# Altium schematic sheet Sheet1.SchDoc
size A2; SheetNumber: 1; SheetTotal: 1
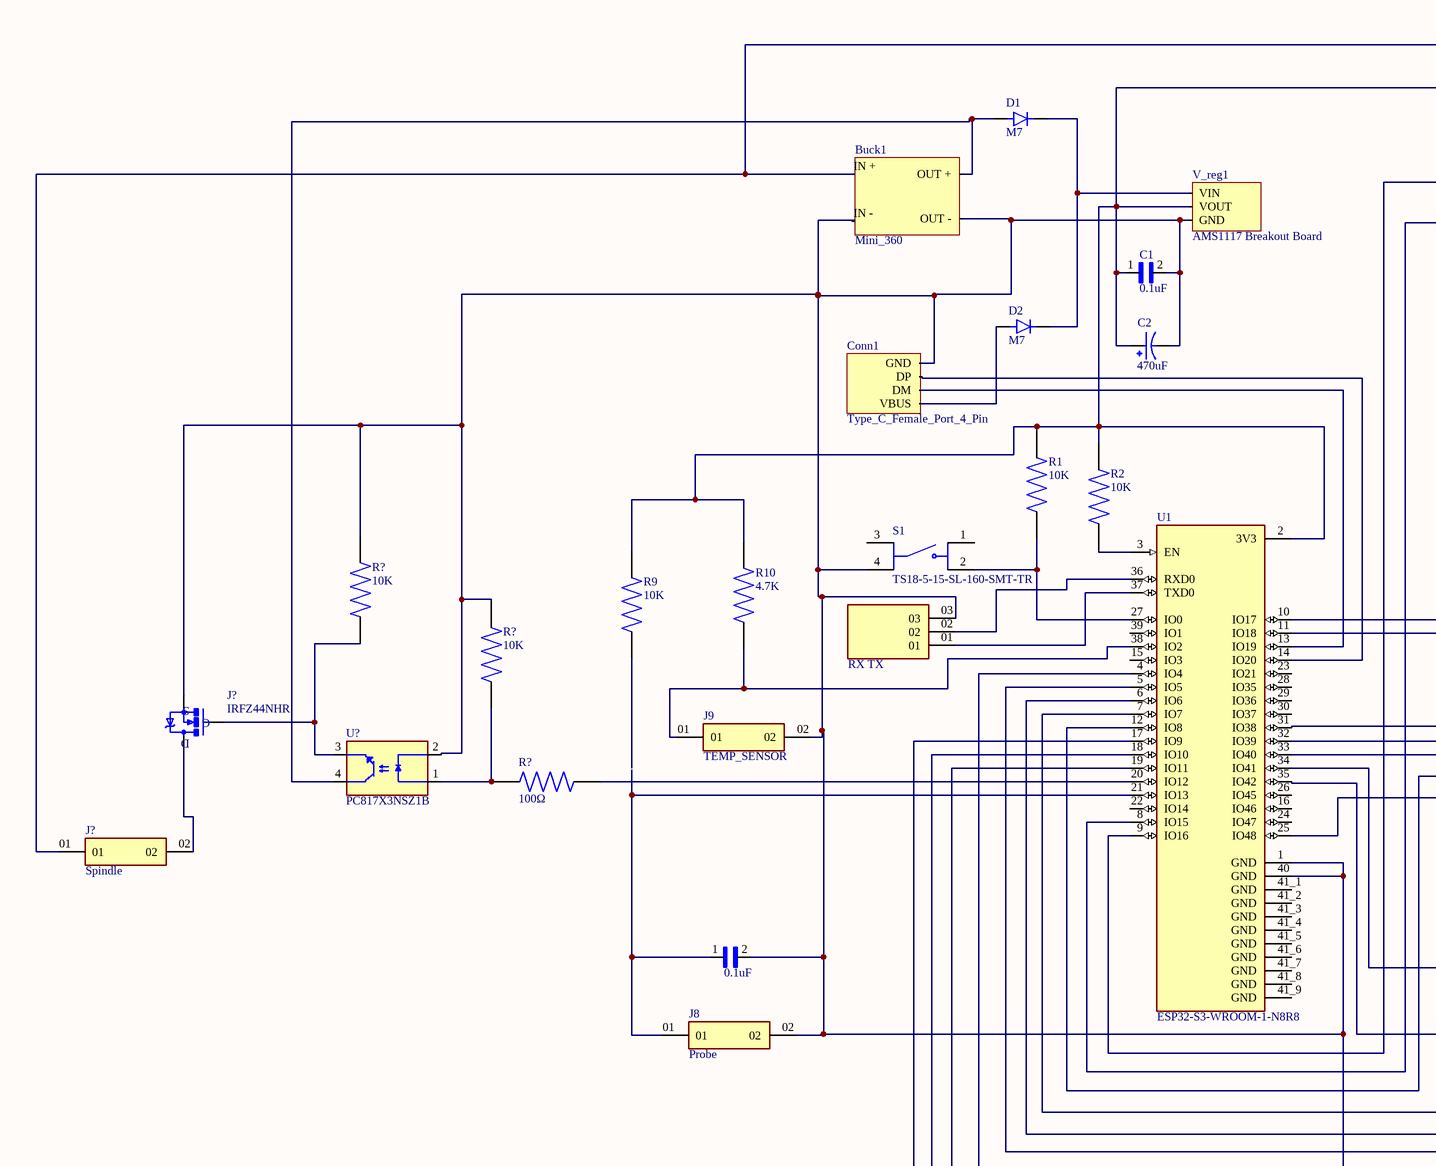
[diagram p0: Sheet1.SchDoc, left]
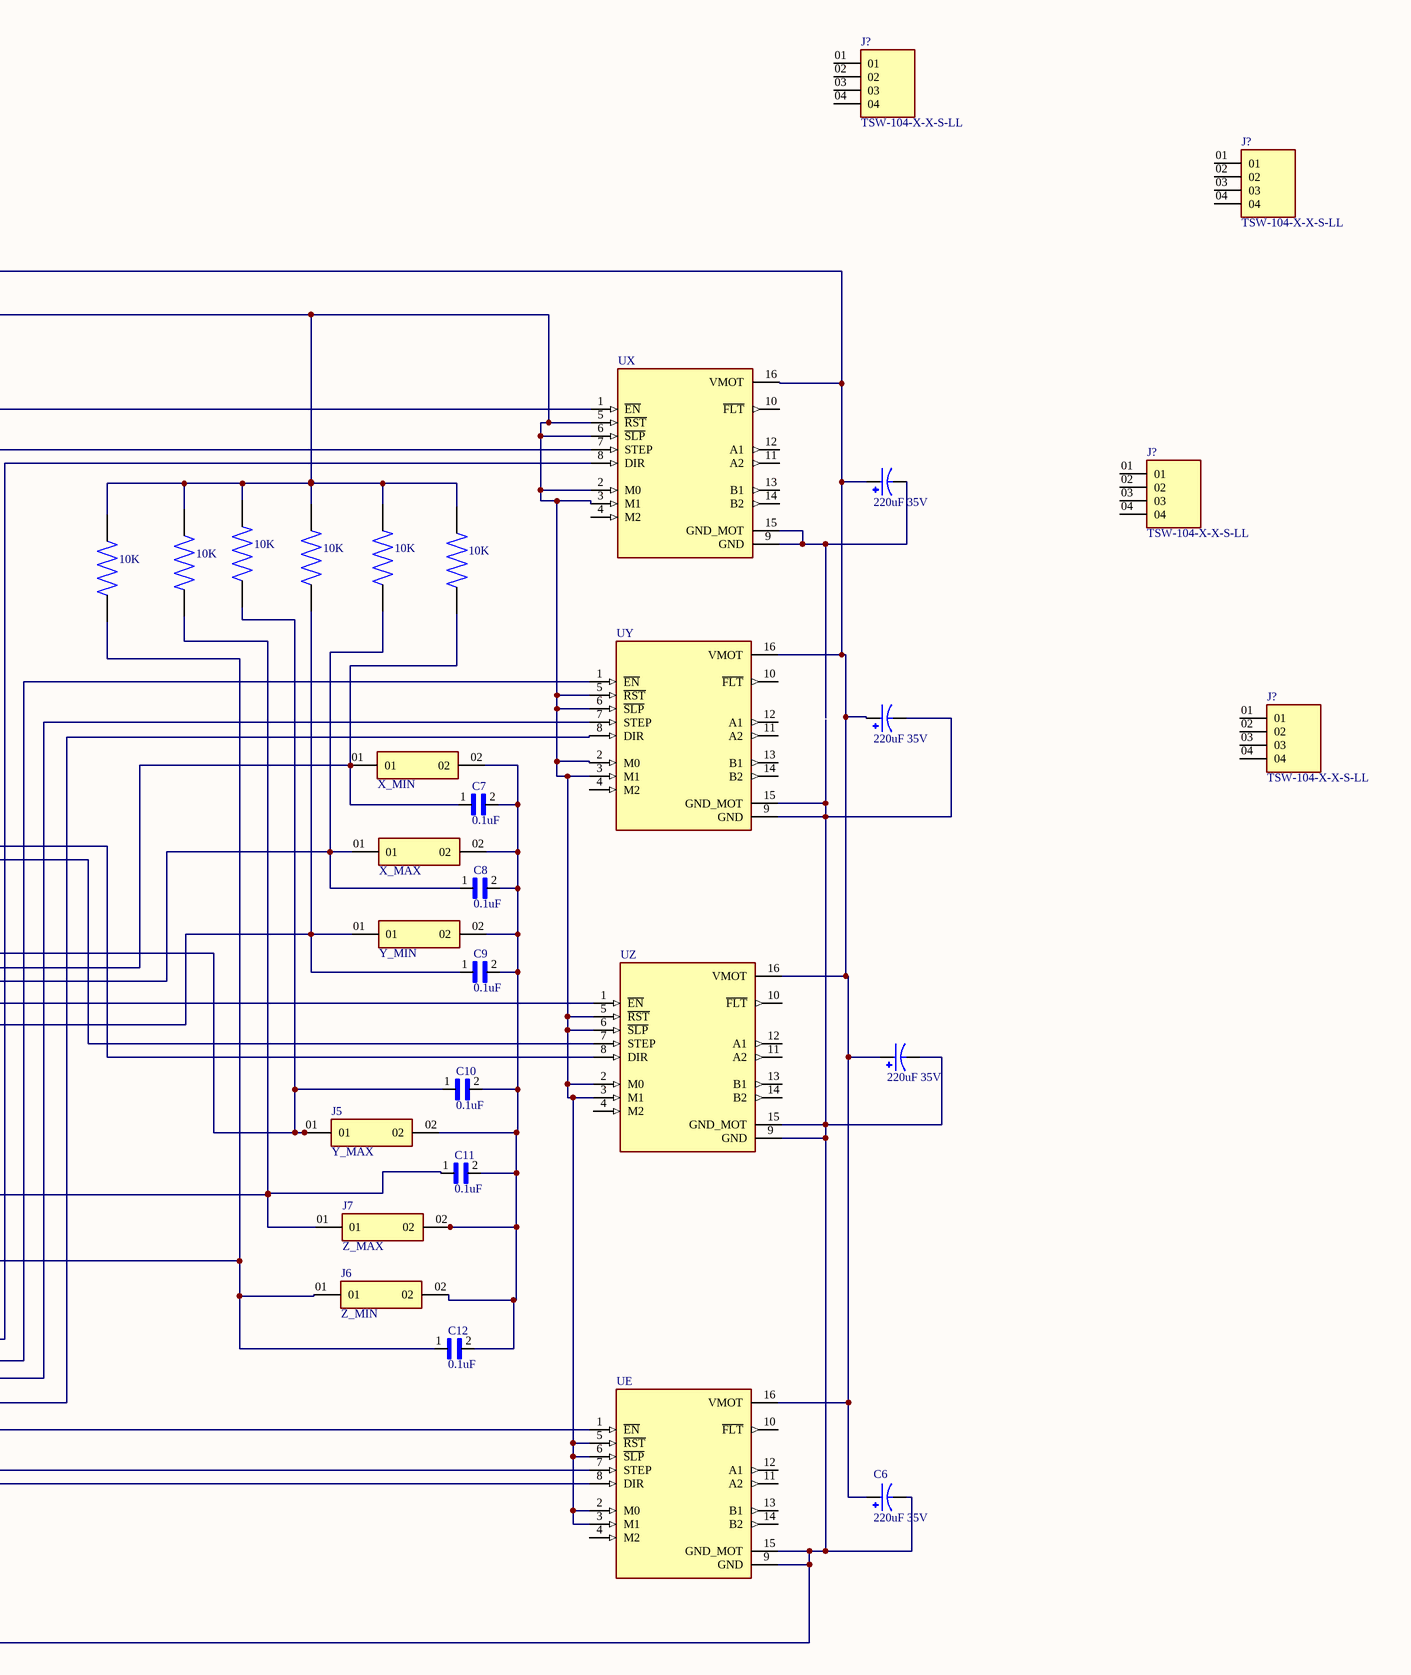
[diagram p1: Sheet1.SchDoc, right]

## Parts
(Parts that share a designator on the sheet are numbered #1, #2 ... from top to bottom, then left to right.)
Buck1  Mini_360  [Buck]
C1  0.1uF  [CAPC3216X180N]
C2  470uF  [CAPPRD500W60D1250H2000]
C3  220uF 35V  [CAPPRD500W60D1000H2000]
C4  220uF 35V  [CAPPRD500W60D1000H2000]
C5  220uF 35V  [CAPPRD500W60D1000H2000]
C6  220uF 35V  [CAPPRD500W60D1000H2000]
C7  0.1uF  [CAPC3216X180N]
C8  0.1uF  [CAPC3216X180N]
C9  0.1uF  [CAPC3216X180N]
C10  0.1uF  [CAPC3216X180N]
C11  0.1uF  [CAPC3216X180N]
C12  0.1uF  [CAPC3216X180N]
C13  0.1uF  [CAPC3216X180N]
Conn1  Type_C_Female_Port_4_Pin  [Type_C_Female_Port_4_Pin]
D1  M7  [DIO_M7]
D2  M7  [DIO_M7]
J1  RX TX  [SAMTEC_TS-103-T-A-1]
J2  X_MIN  [SAMTEC_TSW-101-24-G-D]
J3  X_MAX  [SAMTEC_TSW-101-24-G-D]
J4  Y_MIN  [SAMTEC_TSW-101-24-G-D]
J5  Y_MAX  [SAMTEC_TSW-101-24-G-D]
J6  Z_MIN  [SAMTEC_TSW-101-24-G-D]
J7  Z_MAX  [SAMTEC_TSW-101-24-G-D]
J8  Probe  [SAMTEC_TSW-101-24-G-D]
J9  TEMP_SENSOR  [SAMTEC_TSW-101-24-G-D]
J?#1  TSW-104-X-X-S-LL  [SAMTEC_TSW-104-X-X-S-LL]
J?#2  TSW-104-X-X-S-LL  [SAMTEC_TSW-104-X-X-S-LL]
J?#3  TSW-104-X-X-S-LL  [SAMTEC_TSW-104-X-X-S-LL]
J?#4  TSW-104-X-X-S-LL  [SAMTEC_TSW-104-X-X-S-LL]
J?#5  IRFZ44NHR  [TO-220]
J?#6  Spindle  [SAMTEC_TSW-101-24-G-D]
R1  10K  [RESC3216X75N]
R2  10K  [RESC3216X75N]
R3  10K  [RESC3216X75N]
R4  10K  [RESC3216X75N]
R5  10K  [RESC3216X75N]
R6  10K  [RESC3216X75N]
R7  10K  [RESC3216X75N]
R8  10K  [RESC3216X75N]
R9  10K  [RESC3216X75N]
R10  4.7K  [RESC3216X75N]
R?#1  10K  [RESC3216X75N]
R?#2  10K  [RESC3216X75N]
R?#3  100Ω  [RESC3216X75N]
S1  TS18-5-15-SL-160-SMT-TR  [SW_TS18-5-15-SL-160-SMT-TR]
U1  ESP32-S3-WROOM-1-N8R8  [XCVR_ESP32S3WROOM1N8R8]
U?  PC817X3NSZ1B  [DIP762W50P254L495H455Q4]
UE  DRV8825_STEPPER_MOTOR_DRIVER_CARRIER  [IC_DRV8825_STEPPER_MOTOR_DRIVER_CARRIER]  (value not drawn)
UX  DRV8825_STEPPER_MOTOR_DRIVER_CARRIER  [IC_DRV8825_STEPPER_MOTOR_DRIVER_CARRIER]  (value not drawn)
UY  DRV8825_STEPPER_MOTOR_DRIVER_CARRIER  [IC_DRV8825_STEPPER_MOTOR_DRIVER_CARRIER]  (value not drawn)
UZ  DRV8825_STEPPER_MOTOR_DRIVER_CARRIER  [IC_DRV8825_STEPPER_MOTOR_DRIVER_CARRIER]  (value not drawn)
V_reg1  AMS1117 Breakout Board  [AMS1117 Breakout Board]

## Nets
NetBuck1_IN +: Buck1.IN_+ C3.P C4.P C5.P C6.P J?#6.01 UE.16(VMOT) UX.16(VMOT) UY.16(VMOT) UZ.16(VMOT)
NetBuck1_IN -: Buck1.IN_- Buck1.OUT_- C1.2 C2.N C4.N C5.N C6.N C13.2 Conn1.GND J1.03 J8.02 J9.02 J?#5.3(S) R?#1.2 R?#2.2 S1.4 U1.1(GND) U1.40(GND) U?.2(CATHODE) UE.9(GND) UE.15(GND_MOT) UY.9(GND) UY.15(GND_MOT) UZ.9(GND) UZ.15(GND_MOT) V_reg1.GND
NetBuck1_OUT +: Buck1.OUT_+ D1.A U?.4(COLLECTOR)
NetC1_1: C1.1 C2.P R1.2 R2.2 R3.2 R4.2 R5.2 R6.2 R7.2 R8.2 R9.2 R10.2 U1.2(3V3) UE.2(M0) UE.3(M1) UE.5(~{RST}) UE.6(~{SLP}) UX.2(M0) UX.3(M1) UX.5(~{RST}) UX.6(~{SLP}) UY.2(M0) UY.3(M1) UY.5(~{RST}) UY.6(~{SLP}) UZ.2(M0) UZ.3(M1) UZ.5(~{RST}) UZ.6(~{SLP}) V_reg1.VOUT
NetC3_N: C3.N UX.9(GND) UX.15(GND_MOT)
NetC7_1: C7.1 J2.01 R8.1 U1.32(IO39)
NetC7_2: C7.2 C8.2 C9.2 C10.2 C11.2 C12.2 J2.02 J3.02 J4.02 J5.02 J6.02 J7.02
NetC8_1: C8.1 J3.01 R7.1 U1.33(IO40)
NetC9_1: C9.1 J4.01 R6.1 U1.25(IO48)
NetC10_1: C10.1 J5.01 R5.1 U1.31(IO38)
NetC11_1: C11.1 J7.01 R4.1 U1.34(IO41)
NetC12_1: C12.1 J6.01 R3.1 U1.35(IO42)
NetC13_1: C13.1 J8.01 U1.21(IO13)
NetConn1_DM: Conn1.DM U1.13(IO19)
NetConn1_DP: Conn1.DP U1.14(IO20)
NetConn1_VBUS: Conn1.VBUS D2.A
NetD1_C: D1.C(K) D2.C(K) V_reg1.VIN
NetJ1_01: J1.01 U1.37(TXD0)
NetJ1_02: J1.02 U1.36(RXD0)
NetJ9_01: J9.01 R10.1 U1.38(IO2)
NetJ?#5_1: J?#5.1(G) R?#1.1 U?.3(EMITTER)
NetJ?#5_2: J?#5.2(D) J?#6.02
NetR1_1: R1.1 S1.2 U1.27(IO0)
NetR2_1: R2.1 U1.3(EN)
NetR?#2_1: R?#2.1 R?#3.1 U?.1(ANODE)
NetR?#3_2: R?#3.2 U1.20(IO12)
NetU1_4: U1.4(IO4) UY.8(DIR)
NetU1_5: U1.5(IO5) UY.7(STEP)
NetU1_6: U1.6(IO6) UY.1(~{EN})
NetU1_7: U1.7(IO7) UX.8(DIR)
NetU1_8: U1.8(IO15) UX.7(STEP)
NetU1_9: U1.9(IO16) UX.1(~{EN})
NetU1_10: U1.10(IO17) UZ.8(DIR)
NetU1_11: U1.11(IO18) UZ.7(STEP)
NetU1_12: U1.12(IO8) UZ.1(~{EN})
NetU1_17: U1.17(IO9) UE.8(DIR)
NetU1_18: U1.18(IO10) UE.7(STEP)
NetU1_19: U1.19(IO11) UE.1(~{EN})

Not connected (* = marked no-connect by the designer): J?#1 01 02 03 04; J?#2 01 02 03 04; J?#3 01 02 03 04; J?#4 01 02 03 04; R9 1; S1 1 3; U1 15(IO3) 16(IO46) 22(IO14) 23(IO21) 24(IO47) 26(IO45) 28(IO35) 29(IO36) 30(IO37) 39(IO1) 41_1(GND) 41_2(GND) 41_3(GND) 41_4(GND) 41_5(GND) 41_6(GND) 41_7(GND) 41_8(GND) 41_9(GND); UE 4(M2) 10(~{FLT}) 11(A2) 12(A1) 13(B1) 14(B2); UX 4(M2) 10(~{FLT}) 11(A2) 12(A1) 13(B1) 14(B2); UY 4(M2) 10(~{FLT}) 11(A2) 12(A1) 13(B1) 14(B2); UZ 4(M2) 10(~{FLT}) 11(A2) 12(A1) 13(B1) 14(B2)

## Library data of the parts
Buck1 = Mini 360
C1 C7-C13 = C3216X7S2A155K160AB: 1.5 ÂµF Â±10% 100V Ceramic Capacitor X7S 1206 (3216 Metric); MF: TDK; SnapEDA_Link: https://www.snapeda.com/parts/C3216X7S2A155K160AB/TDK/view-part/?ref=snap; Value: *; MP: C3216X7S2A155K160AB; Check_prices: https://www.snapeda.com/parts/C3216X7S2A155K160AB/TDK/view-part/?ref=eda; Purchase-URL: https://pricing.snapeda.com/search/part/C3216X7S2A155K160AB/?ref=eda; Package: 3216 TDK; Digi-Key_Part_Number: 445-14816-1-ND
C2 = EEUTP1V471: CAP ALUM 470UF 20% 35V RADIAL; MP: EEU-TP1V471; MF: Panasonic; Package: RADIAL-2 Panasonic; Price: None; Availability: In Stock; Value: *; Check_prices: https://www.snapeda.com/parts/EEU-TP1V471/Panasonic/view-part/2304886/?ref=eda; SnapEDA_Link: https://www.snapeda.com/parts/EEU-TP1V471/Panasonic/view-part/2304886/?ref=snap
C3-C6 = EEUFR2A101: Aluminum Electrolytic Capacitors - Radial Leaded 100VDC 100uF 20% L/S=5mm; MF: Panasonic; MP: EEU-FR2A101; Availability: In Stock; Price: None; SnapEDA_Link: https://www.snapeda.com/parts/EEU-FR2A101/Panasonic/view-part/6222715/?ref=snap; Value: *; Check_prices: https://www.snapeda.com/parts/EEU-FR2A101/Panasonic/view-part/6222715/?ref=eda; Package: RADIAL-2 Panasonic
D1 D2 = M7: MF: {'manufacturer': u'Diotec Semiconductor'}; Package: None; Price: None; Value: *; MP: M7; Availability: Unavailable
J1 = TS-103-T-A-1: Connector Header position; MF: Samtec; Check_prices: https://www.snapeda.com/parts/TS-103-T-A-1/Samtec/view-part/?ref=eda; Value: *; Availability: In Stock; MP: TS-103-T-A-1; Price: None; Package: None; SnapEDA_Link: https://www.snapeda.com/parts/TS-103-T-A-1/Samtec/view-part/?ref=snap; Purchase-URL: https://pricing.snapeda.com/search/part/TS-103-T-A-1/?ref=eda
J2-J9 J?#6 = TSW-101-24-G-D: Package: None; Price: None; Value: *; MP: TSW-101-24-G-D; Availability: Unavailable
J?#1-J?#4 = TSW-104-X-X-S-LL: Conn Unshrouded Header HDR 4 POS 2.54mm Solder ST Top Entry Thru-Hole Bulk; MF: Samtec; MP: TSW-104-23-H-S-LL; SnapEDA_Link: https://www.snapeda.com/parts/TSW-104-23-H-S-LL/Samtec/view-part/?ref=snap; Package: None; Value: *; Check_prices: https://www.snapeda.com/parts/TSW-104-23-H-S-LL/Samtec/view-part/?ref=eda
J?#5 = IRFZ44NHR: Infineon; Package: None; MP: IRFZ44NHR; Price: None; MF: Infineon; Availability: Not in stock; Value: *; Check_prices: https://www.snapeda.com/parts/IRFZ44NHR/Infineon/view-part/?ref=eda; SnapEDA_Link: https://www.snapeda.com/parts/IRFZ44NHR/Infineon/view-part/?ref=snap
R1 R2 R9 R10 R?#1-R?#3 = CR1206-J/-000ELF: CR1206 SMD Thick Film Resistor,jumper 0R | Bourns CR1206-J/-000ELF; SnapEDA_Link: https://www.snapeda.com/parts/CR1206-J/-000ELF/Bourns/view-part/?ref=snap; Package: 3216 Bourns; Value: *; MF: Bourns; MP: CR1206-J/-000ELF; Check_prices: https://www.snapeda.com/parts/CR1206-J/-000ELF/Bourns/view-part/?ref=eda
R3-R8 = CR1206-J/-000ELF: MF: Bourns; SnapEDA_Link: https://www.snapeda.com/parts/CR1206-J/-000ELF/Bourns/view-part/?ref=snap; Package: 3216 Bourns; Value: *; MP: CR1206-J/-000ELF; Check_prices: https://www.snapeda.com/parts/CR1206-J/-000ELF/Bourns/view-part/?ref=eda
U1 = ESP32-S3-WROOM-1-N8R8: Bluetooth, WiFi 802.11b/g/n, Bluetooth v5.0 Transceiver Module 2.4GHz PCB Trace Surface Mount; MF: Espressif Systems; Package: None; Price: None; Check_prices: https://www.snapeda.com/parts/ESP32-S3-WROOM-1-N8R8/Espressif+Systems/view-part/?ref=eda; Value: *; SnapEDA_Link: https://www.snapeda.com/parts/ESP32-S3-WROOM-1-N8R8/Espressif+Systems/view-part/?ref=snap; MP: ESP32-S3-WROOM-1-N8R8; Availability: In Stock; Purchase-URL: https://pricing.snapeda.com/search?q=ESP32-S3-WROOM-1-N8R8&ref=eda
U? = PC817X3NSZ1B: Optoisolator Transistor Output - 1 Channel 4-DIP; MF: Sharp Microelectronics; SnapEDA_Link: https://www.snapeda.com/parts/PC817X3NSZ1B/Sharp+Microelectronics/view-part/?ref=snap; Price: None; Purchase-URL: https://pricing.snapeda.com/search/part/PC817X3NSZ1B/?ref=eda; Check_prices: https://www.snapeda.com/parts/PC817X3NSZ1B/Sharp+Microelectronics/view-part/?ref=eda; MP: PC817X3NSZ1B; Value: *; Availability: In Stock; Package: DIP-4 Sharp Microelectronics
UE UX UY UZ = DRV8825_STEPPER_MOTOR_DRIVER_CARRIER: Stepper motor controler; IC: DRV8825; 1.5A; Uin mot: 8.2Ã·45V; Availability: Unavailable; MP: DRV8825_STEPPER_MOTOR_DRIVER_CARRIER; Value: *; Price: None; Package: None
S1 = TS18-5-15-SL-160-SMT-TR: Package: None; Price: None; Value: *; MP: TS18-5-15-SL-160-SMT-TR; Availability: Unavailable